# Altium schematic sheet Main.SchDoc
size A4
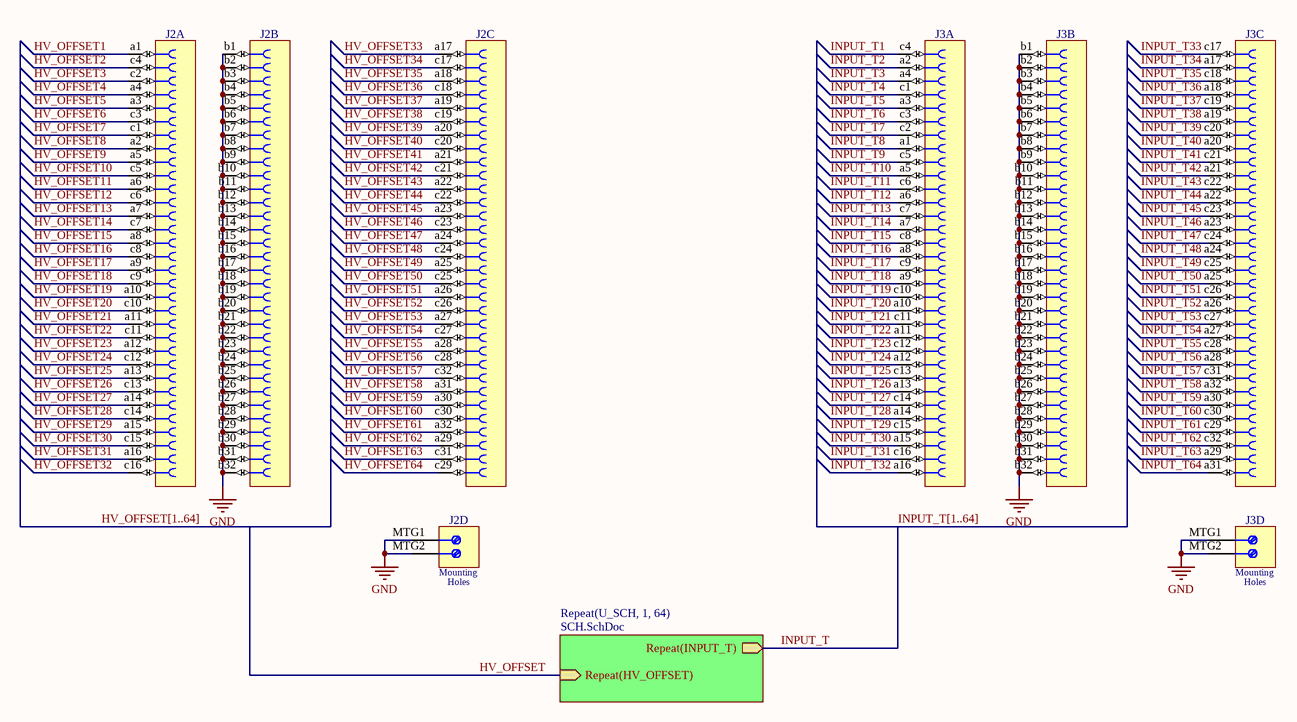
[diagram p0: Main.SchDoc]

## Parts
J2  DIN 41612 Type C  [HARTING_09 03 296 6861]  (value not drawn)  (parts A,B,C,D of 4)
J3  DIN 41612 Type C  [HARTING_09 03 296 6861]  (value not drawn)  (parts A,B,C,D of 4)

## Sub-sheets
Repeat(U_SCH, 1, 64) = SCH.SchDoc: Repeat(INPUT_T) (out), Repeat(HV_OFFSET) (in)

## Nets
GND: J2.b1 J2.b2 J2.b3 J2.b4 J2.b5 J2.b6 J2.b7 J2.b8 J2.b9 J2.b10 J2.b11 J2.b12 J2.b13 J2.b14 J2.b15 J2.b16 J2.b17 J2.b18 J2.b19 J2.b20 J2.b21 J2.b22 J2.b23 J2.b24 J2.b25 J2.b26 J2.b27 J2.b28 J2.b29 J2.b30 J2.b31 J2.b32 J2.MTG1 J2.MTG2 J3.b1 J3.b2 J3.b3 J3.b4 J3.b5 J3.b6 J3.b7 J3.b8 J3.b9 J3.b10 J3.b11 J3.b12 J3.b13 J3.b14 J3.b15 J3.b16 J3.b17 J3.b18 J3.b19 J3.b20 J3.b21 J3.b22 J3.b23 J3.b24 J3.b25 J3.b26 J3.b27 J3.b28 J3.b29 J3.b30 J3.b31 J3.b32 J3.MTG1 J3.MTG2
HV_OFFSET: sheet Repeat(U_SCH, 1, 64)/Repeat(HV_OFFSET)
HV_OFFSET1: J2.a1
HV_OFFSET2: J2.c4
HV_OFFSET3: J2.c2
HV_OFFSET4: J2.a4
HV_OFFSET5: J2.a3
HV_OFFSET6: J2.c3
HV_OFFSET7: J2.c1
HV_OFFSET8: J2.a2
HV_OFFSET9: J2.a5
HV_OFFSET10: J2.c5
HV_OFFSET11: J2.a6
HV_OFFSET12: J2.c6
HV_OFFSET13: J2.a7
HV_OFFSET14: J2.c7
HV_OFFSET15: J2.a8
HV_OFFSET16: J2.c8
HV_OFFSET17: J2.a9
HV_OFFSET18: J2.c9
HV_OFFSET19: J2.a10
HV_OFFSET20: J2.c10
HV_OFFSET21: J2.a11
HV_OFFSET22: J2.c11
HV_OFFSET23: J2.a12
HV_OFFSET24: J2.c12
HV_OFFSET25: J2.a13
HV_OFFSET26: J2.c13
HV_OFFSET27: J2.a14
HV_OFFSET28: J2.c14
HV_OFFSET29: J2.a15
HV_OFFSET30: J2.c15
HV_OFFSET31: J2.a16
HV_OFFSET32: J2.c16
HV_OFFSET33: J2.a17
HV_OFFSET34: J2.c17
HV_OFFSET35: J2.a18
HV_OFFSET36: J2.c18
HV_OFFSET37: J2.a19
HV_OFFSET38: J2.c19
HV_OFFSET39: J2.a20
HV_OFFSET40: J2.c20
HV_OFFSET41: J2.a21
HV_OFFSET42: J2.c21
HV_OFFSET43: J2.a22
HV_OFFSET44: J2.c22
HV_OFFSET45: J2.a23
HV_OFFSET46: J2.c23
HV_OFFSET47: J2.a24
HV_OFFSET48: J2.c24
HV_OFFSET49: J2.a25
HV_OFFSET50: J2.c25
HV_OFFSET51: J2.a26
HV_OFFSET52: J2.c26
HV_OFFSET53: J2.a27
HV_OFFSET54: J2.c27
HV_OFFSET55: J2.a28
HV_OFFSET56: J2.c28
HV_OFFSET57: J2.c32
HV_OFFSET58: J2.a31
HV_OFFSET59: J2.a30
HV_OFFSET60: J2.c30
HV_OFFSET61: J2.a32
HV_OFFSET62: J2.a29
HV_OFFSET63: J2.c31
HV_OFFSET64: J2.c29
INPUT_T: sheet Repeat(U_SCH, 1, 64)/Repeat(INPUT_T)
INPUT_T1: J3.c4
INPUT_T2: J3.a2
INPUT_T3: J3.a4
INPUT_T4: J3.c1
INPUT_T5: J3.a3
INPUT_T6: J3.c3
INPUT_T7: J3.c2
INPUT_T8: J3.a1
INPUT_T9: J3.c5
INPUT_T10: J3.a5
INPUT_T11: J3.c6
INPUT_T12: J3.a6
INPUT_T13: J3.c7
INPUT_T14: J3.a7
INPUT_T15: J3.c8
INPUT_T16: J3.a8
INPUT_T17: J3.c9
INPUT_T18: J3.a9
INPUT_T19: J3.c10
INPUT_T20: J3.a10
INPUT_T21: J3.c11
INPUT_T22: J3.a11
INPUT_T23: J3.c12
INPUT_T24: J3.a12
INPUT_T25: J3.c13
INPUT_T26: J3.a13
INPUT_T27: J3.c14
INPUT_T28: J3.a14
INPUT_T29: J3.c15
INPUT_T30: J3.a15
INPUT_T31: J3.c16
INPUT_T32: J3.a16
INPUT_T33: J3.c17
INPUT_T34: J3.a17
INPUT_T35: J3.c18
INPUT_T36: J3.a18
INPUT_T37: J3.c19
INPUT_T38: J3.a19
INPUT_T39: J3.c20
INPUT_T40: J3.a20
INPUT_T41: J3.c21
INPUT_T42: J3.a21
INPUT_T43: J3.c22
INPUT_T44: J3.a22
INPUT_T45: J3.c23
INPUT_T46: J3.a23
INPUT_T47: J3.c24
INPUT_T48: J3.a24
INPUT_T49: J3.c25
INPUT_T50: J3.a25
INPUT_T51: J3.c26
INPUT_T52: J3.a26
INPUT_T53: J3.c27
INPUT_T54: J3.a27
INPUT_T55: J3.c28
INPUT_T56: J3.a28
INPUT_T57: J3.c31
INPUT_T58: J3.a32
INPUT_T59: J3.a30
INPUT_T60: J3.c30
INPUT_T61: J3.c29
INPUT_T62: J3.c32
INPUT_T63: J3.a29
INPUT_T64: J3.a31

## Buses and harness runs
bus HV_OFFSET[1..64]
bus INPUT_T[1..64]

## Notes on the sheet
- (in symbol HARTING_09 03 296 6861, part D) Mounting; Holes

## Library data of the parts
J2 J3 = HARTING_09 03 296 6861: Connector 96abc Female (3x32); Part Description: DIN 41612, Type C, 96 Position, Rows a+b+c, Performance level 2, Press-in Lead Lead 13mm, Pitch 2.54mm, Straight Female Connector; Part Number: HARTING_09 03 296 6861; Component Kind: Standard; Component Type: Standard; Pin Count: 98; Family: DIN 41612 Type C; Mounted: Yes; Socket: No; SMD: No; PressFit: Yes; Sense: No; Status: None; Manufacturer: HARTING; Manufacturer Part Number: 09 03 296 6861; ComponentHeight: 11.6mm; HelpURL: \\cern.ch\dfs\Applications\Altium\Datasheets\HARTING_09 03 296 6861.pdf; Author: CERN DEM JLC; CreateDate: 19.12.2016; LatestRevisionDate: 19.12.2016